# Altium schematic sheet Sin wave留存版本.SchDoc
size A4
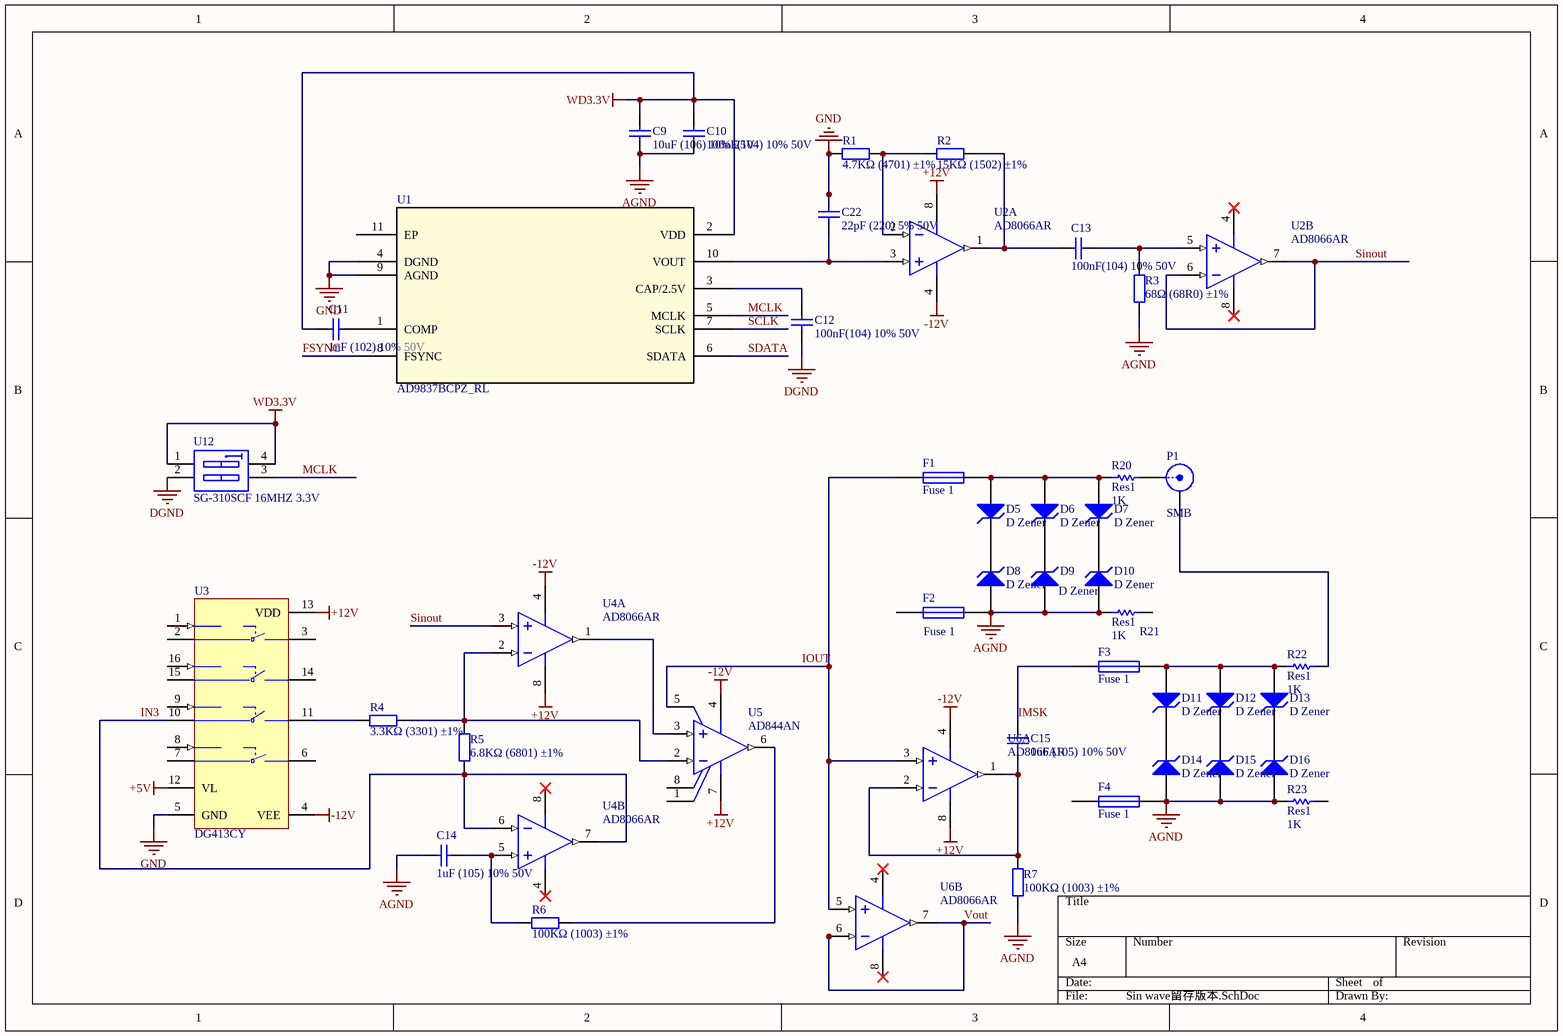
[diagram p0: Sin wave留存版本.SchDoc]

## Parts
C9  10uF (106) 10% 25V  [LC-0805_C]
C10  100nF(104) 10% 50V  [LC-0805_C]
C11  1nF (102) 10% 50V  [LC-0805_C]
C12  100nF(104) 10% 50V  [LC-0805_C]
C13  100nF(104) 10% 50V  [LC-0805_C]
C14  1uF (105) 10% 50V  [LC-0805_C]
C15  1uF (105) 10% 50V  [LC-0805_C]
C22  22pF (220) 5% 50V  [LC-0805_C]
D5  D Zener  [DIODE-0.7]
D6  D Zener  [DIODE-0.7]
D7  D Zener  [DIODE-0.7]
D8  D Zener  [DIODE-0.7]
D9  D Zener  [DIODE-0.7]
D10  D Zener  [DIODE-0.7]
D11  D Zener  [DIODE-0.7]
D12  D Zener  [DIODE-0.7]
D13  D Zener  [DIODE-0.7]
D14  D Zener  [DIODE-0.7]
D15  D Zener  [DIODE-0.7]
D16  D Zener  [DIODE-0.7]
F1  Fuse 1  [PIN-W2/E2.8]
F2  Fuse 1  [PIN-W2/E2.8]
F3  Fuse 1  [PIN-W2/E2.8]
F4  Fuse 1  [PIN-W2/E2.8]
P1  SMB  [SMB_V-RJ45]
R1  4.7KΩ (4701) ±1%  [LC-0805_R]
R2  15KΩ (1502) ±1%  [LC-0805_R]
R3  68Ω (68R0) ±1%  [LC-0805_R]
R4  3.3KΩ (3301) ±1%  [LC-0805_R]
R5  6.8KΩ (6801) ±1%  [LC-0805_R]
R6  100KΩ (1003) ±1%  [LC-0805_R]
R7  100KΩ (1003) ±1%  [LC-0805_R]
R20  Res1  value 1K  [AXIAL-0.3]
R21  Res1  value 1K  [AXIAL-0.3]
R22  Res1  value 1K  [AXIAL-0.3]
R23  Res1  value 1K  [AXIAL-0.3]
U1  AD9837BCPZ_RL  [CP_10_9]
U2  AD8066AR  [ADI-R-8_N]  (parts A,B of 2)
U3  DG413CY  [NSO16_N]
U4  AD8066AR  [ADI-R-8_N]  (parts A,B of 2)
U5  AD844AN  [ADI-N-8]
U6  AD8066AR  [ADI-R-8_N]  (parts A,B of 2)
U12  SG-310SCF 16MHZ 3.3V  [LC-SMD-7050_4P]

## Nets
+5V: U3.12(VL)
+12V: U2.8(+VS) U3.13(VDD) U4.8(+VS) U5.7(+VS) U6.8(+VS)
-12V: U2.4(-VS) U3.4(VEE) U4.4(-VS) U5.4(-VS) U6.4(-VS)
AGND: C9.1 C10.1 C14.1 D8.1(A) D9.1(A) D10.1(A) D14.1(A) D15.1(A) D16.1(A) F2.2 F4.2 R3.1 R7.1 R21.1 R23.1
DGND: C12.1 U12.2(A2)
GND: C22.2 R1.1 U1.4(DGND) U1.9(AGND) U3.5(GND)
WD3.3V: C9.2 C10.2 C11.1 U1.2(VDD) U12.1(A1) U12.4(B1)
FSYNC: U1.8(FSYNC)
IMSK: C15.2 F3.1
IN3: R5.1 U3.10(D3) U4.6(-IN_2) U4.7(VOUT_2)
IOUT: F1.1 U5.5(TZ) U6.3(+IN_1) U6.5(+IN_2)
MCLK: U1.5(MCLK) U12.3(B2)
SCLK: U1.7(SCLK)
SDATA: U1.6(SDATA)
Sinout: U2.6(-IN_2) U2.7(VOUT_2) U4.3(+IN_1)
Vout: U6.6(-IN_2) U6.7(VOUT_2)
NetC11_2: C11.2 U1.1(COMP)
NetC12_2: C12.2 U1.3(CAP/2.5V)
NetC13_1: C13.1 R2.2 U2.1(VOUT_1)
NetC13_2: C13.2 R3.2 U2.5(+IN_2)
NetC14_2: C14.2 R6.1 U4.5(+IN_2)
NetC15_1: C15.1 R7.2 U6.1(VOUT_1) U6.2(-IN_1)
NetC22_1: C22.1 U1.10(VOUT) U2.3(+IN_1)
NetD5_1: D5.1(A) D6.1(A) D7.1(A) F1.2 R20.1
NetD5_2: D5.2(K) D8.2(K)
NetD6_2: D6.2(K) D9.2(K)
NetD7_2: D7.2(K) D10.2(K)
NetD11_1: D11.1(A) D12.1(A) D13.1(A) F3.2 R22.1
NetD11_2: D11.2(K) D14.2(K)
NetD12_2: D12.2(K) D15.2(K)
NetD13_2: D13.2(K) D16.2(K)
NetP1_1: P1.1(X) R20.2
NetP1_2: P1.2(Y) R22.2
NetR1_2: R1.2 R2.1 U2.2(-IN_1)
NetR4_1: R4.1 U3.11(S3)
NetR4_2: R4.2 R5.2 U4.2(-IN_1) U5.2(-IN)
NetR6_2: R6.2 U5.6(OUTPUT)
NetU4_1: U4.1(VOUT_1) U5.3(+IN)

Not connected (* = marked no-connect by the designer): F2 1; F4 1; R21 2; R23 2; U1 11(EP); U3 1(IN1) 2(D1) 3(S1) 6(S4) 7(D4) 8(IN_4) 9(IN3) 14(S2) 15(D2) 16(IN2); U5 1(NULL) 8(NULL)

## Library data of the parts
C9 = 0805 10uF (106) 10% 25V: 贴片电容; ComponentLink1Description: 供应商链接; ComponentLink1URL: http://www.szlcsc.com/product/details_16532.html; Package: 0805; Supplier: LC; SuppliersPartNumber: C15850
C10 C12 C13 = 0805 100nF(104) 10% 50V: 贴片电容; ComponentLink1Description: 供应商链接; ComponentLink1URL: http://www.szlcsc.com/product/details_50686.html; Package: 0805; Supplier: LC; SuppliersPartNumber: C49678
C11 = 0805 1nF (102) 10% 50V: 贴片电容; ComponentLink1Description: 供应商链接; ComponentLink1URL: http://www.szlcsc.com/product/details_52223.html; Package: 0805; Supplier: LC; SuppliersPartNumber: C51210
C14 C15 = 0805 1uF (105) 10% 50V: 贴片电容; ComponentLink1Description: 供应商链接; ComponentLink1URL: http://www.szlcsc.com/product/details_29074.html; Package: 0805; Supplier: LC; SuppliersPartNumber: C28323
C22 = 0805 22pF (220) 5% 50V: 贴片电容; ComponentLink1Description: 供应商链接; ComponentLink1URL: http://www.szlcsc.com/product/details_2156.html; Package: 0805; Supplier: LC; SuppliersPartNumber: C1804
D5-D16 = D Zener: Zener Diode; Published: 8-Jun-2000; LatestRevisionDate: 17-Jul-2002; LatestRevisionNote: Re-released for DXP Platform.; PackageReference: DIODE-0.7; Publisher: Altium Limited; PackageDescription: Diode, Thru-Hole; 2 Leads; 0.7 in Pin Spacing
F1-F4 = Fuse 1: Fuse; Published: 8-Jun-2000; LatestRevisionDate: 17-Jul-2002; LatestRevisionNote: Re-released for DXP Platform.; PackageReference: PIN-W2/E2.8; Publisher: Altium Limited; PackageDescription: Thru-Hole; 2 Leads
P1 = SMB: SMB Straight Connector; LatestRevisionDate: 17-Jul-2002; LatestRevisionNote: Re-released for DXP Platform.; Publisher: Altium Limited
R1 = 0805 4.7KΩ (4701) 1%: 贴片电阻; ComponentLink1Description: 供应商链接; ComponentLink1URL: http://www.szlcsc.com/product/details_18361.html; Package: 0805; Supplier: LC; SuppliersPartNumber: C17673
R2 = 0805 15KΩ (1502) 1%: 贴片电阻; ComponentLink1Description: 供应商链接; ComponentLink1URL: http://www.szlcsc.com/product/details_18163.html; Package: 0805; Supplier: LC; SuppliersPartNumber: C17475
R3 = 0805 68Ω (68R0) 1%: 贴片电阻; ComponentLink1Description: 供应商链接; ComponentLink1URL: http://www.szlcsc.com/product/details_18490.html; Package: 0805; Supplier: LC; SuppliersPartNumber: C17802
R4 = 0805 3.3KΩ (3301) 1%: 贴片电阻; ComponentLink1Description: 供应商链接; ComponentLink1URL: http://www.szlcsc.com/product/details_26753.html; Package: 0805; Supplier: LC; SuppliersPartNumber: C26010
R5 = 0805 6.8KΩ (6801) 1%: 贴片电阻; ComponentLink1Description: 供应商链接; ComponentLink1URL: http://www.szlcsc.com/product/details_18460.html; Package: 0805; Supplier: LC; SuppliersPartNumber: C17772
R6 R7 = 0805 100KΩ (1003) 1%: 贴片电阻; ComponentLink1Description: 供应商链接; ComponentLink1URL: http://www.szlcsc.com/product/details_18095.html; Package: 0805; Supplier: LC; SuppliersPartNumber: C17407
R20-R23 = Res1: Resistor; Published: 8-Jun-2000; LatestRevisionDate: 17-Jul-2002; LatestRevisionNote: Re-released for DXP Platform.; PackageReference: AXIAL-0.3; Publisher: Altium Limited; PackageDescription: Axial Device, Thru-Hole; 2 Leads; 0.3 in Pin Spacing
U1 = AD9837BCPZ_RL: Imported; Value: Value; Type: Type; RefDes: RefDes
U2 U4 U6 = AD8066AR: Double Channel Low Power Operational Amplifier, 145 MHz BW, 180 V/us SR, Industrial, 8-pin SOIC (R-8), Tube; Generic Part Number: AD8066; Manufacturer: Analog Devices; Amplifiers Per Package: 2; Input Bias Current: 2pA; Input Offset Voltage: 400uV; Iq/Amp: 7.4mA; Small Signal Bandwidth: 145MHz; V Span Max: 24V; V Span Min: 5V; DatasheetVersion: Rev. J; PackageVersion: 060506-A; PackageReference: R-8; PackageDescription: 8-Pin Standard Small Outline Package, Body 3.9 x 4.9 mm, Pitch 1.27 mm; Supplier 1: Digi-Key; Supplier Part Number 1: AD8066AR-ND; Slew Rate: 180V/us; Mounting Technology: Surface Mount; Code_JEDEC: MS-012-AA; PartNumber: AD8066AR; ComponentLink1Description: Manufacturer URL; ComponentLink1URL: http://www.analog.com/en/index.html; ComponentLink2Description: Datasheet; ComponentLink2URL: http://www.analog.com/static/imported-files/data_sheets/AD8065_8066.pdf; ComponentLink3Description: Package Specification; ComponentLink3URL: http://www.analog.com/static/imported-files/packages/PKG_PDF/SOIC_Narrow%20(R)/R_8.pdf; ComponentLink4Description: Reference Circuit; ComponentLink4URL: http://www.analog.com/en/all-operational-amplifiers-op-amps/operational-amplifiers-op-amps/ad8066/products/product.html#product-recommendations
U3 = DG413CY: Improved, Quad, SPST Analog Switches; Published: 16-Jan-2001; LatestRevisionDate: 13-Apr-2006; LatestRevisionNote: IPC-7351 Footprint Added.; DatasheetVersion: Aug-1995; PackageReference: NSO16; Publisher: Altium Limited; PackageDescription: 16-Pin Small Outline Integrated Circuit 1.27 mm Pitch; Code_JEDEC: MS-012-AC; Code_IPC: SOIC127P600-16; ComponentLink1Description: Manufacturer Link; ComponentLink1URL: http://www.maxim-ic.com/; ComponentLink2Description: Datasheet; ComponentLink2URL: http://pdfserv.maxim-ic.com/en/ds/DG411-DG413.pdf
U5 = AD844AN: Single Channel Wide Bandwidth Operational Amplifier, 60 MHz BW, 2 KV/us SR, Industrial, 8-pin DIP (N-8), Tube; Generic Part Number: AD844; Manufacturer: Analog Devices; Amplifiers Per Package: 1; Input Bias Current: 150nA; Input Offset Voltage: 50uV; Iq/Amp: 6.5mA; Slew Rate: 2KV/us; Small Signal Bandwidth: 60MHz; V Span Max: 36V; V Span Min: 9V; DatasheetVersion: Rev. F; PackageVersion: 070606-A; PackageReference: N-8; PackageDescription: 8-Pin Plastic Dual In-Line Package, Row spacing 7.62 mm, Pitch 2.54 mm; Supplier 1: Digi-Key; Supplier Part Number 1: AD844AN-ND; Packing: Tube; Mounting Technology: Through Hole; Code_JEDEC: MS-001; PartNumber: AD844AN; ComponentLink1Description: Manufacturer URL; ComponentLink1URL: http://www.analog.com/en/index.html; ComponentLink2Description: Datasheet; ComponentLink2URL: http://www.analog.com/static/imported-files/data_sheets/AD844.pdf; ComponentLink3Description: Package Specification; ComponentLink3URL: http:/www.analog.com/static/imported-files/packages/PKG_PDF/PDIP(N)/N_8.pdf
U12 = SW DIP-2: DIP Switch, 2 Position, SPST; Published: 24-Mar-1999; LatestRevisionDate: 17-Jul-2002; LatestRevisionNote: Re-released for DXP Platform.; PackageReference: DIP-4; Publisher: Altium Limited